# EAGLE design modbus (EAGLE 6.4)
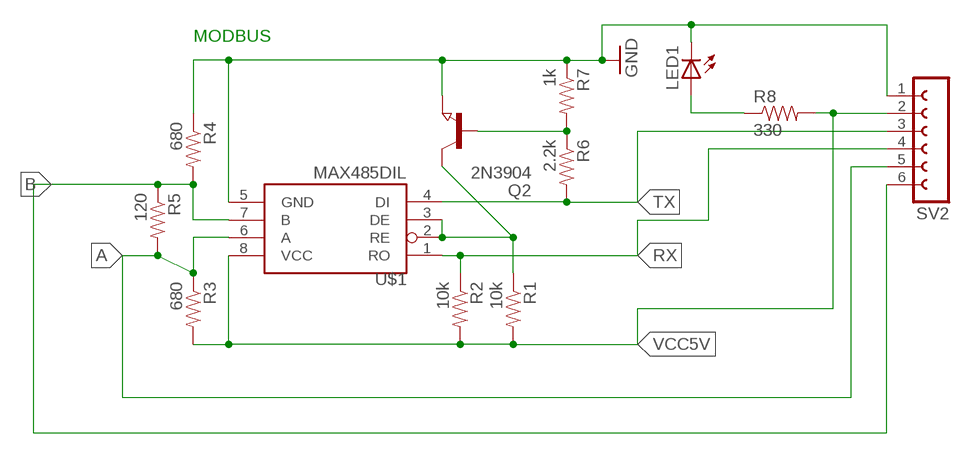
[diagram p0: schematic, sheet 1]

## Parts
LED1  LEDCHIP-LED0805  [CHIP-LED0805]
Q2  2N3904  NPN-TRANSISTOR_SOT23  [SOT23]
R1  10k  RESISTOR0805-RES  [0805]
R2  10k  RESISTOR0805-RES  [0805]
R3  680  RESISTOR0805-RES  [0805]
R4  680  RESISTOR0805-RES  [0805]
R5  120  RESISTOR0805-RES  [0805]
R6  2.2k  RESISTOR0805-RES  [0805]
R7  1k  RESISTOR0805-RES  [0805]
R8  330  RESISTOR0805-RES  [0805]
SV2  FE06-1  [FE06]
U$1  MAX485DIL  [DIL08]

## Nets
A: R3.1 R5.2 SV2.5 U$1.6(A)
B: R4.2 R5.1 SV2.6 U$1.7(B)
GND: LED1.C Q2.2(E) R4.1 R7.1 SV2.1 U$1.5(GND)
N$1: LED1.A R8.1
N$2: Q2.3(C) R1.1 U$1.2(RE) U$1.3(DE)
N$4: Q2.1(B) R6.1 R7.2
RX: R2.1 SV2.4 U$1.1(RO)
TX: R6.2 SV2.3 U$1.4(DI)
VCC5V: R1.2 R2.2 R3.2 R8.2 SV2.2 U$1.8(VCC)

## Notes on the sheet
- MODBUS

## Library data of the parts
LED1 = led:LED: LED OSRAM: - CHIPLED LG R971, LG N971, LY N971, LG Q971, LY Q971, LO R971, LY R971 LH N974, LH R974 LS Q976, LO Q976, LY Q976 LO Q996 - Hyper CHIPLED LW Q18S LB Q993, LB Q99A, LB R99A - SideLED LS A670, LO A670, LY A670, LG A670, LP A670 LB A673, LV A673, LT A673, LW A673 LH A674 LY A675 LS A676, LA A676, LO A676, LY A676, LW A676 LS A679, LY A679, LG A679 - Hyper Micro SIDELED® LS Y876, LA Y876, LO Y876, LY Y876 LT Y87S - SmartLED LW L88C, LW L88S LB L89C, LB L89S, LG L890 LS L89K, LO L89K, LY L89K LS L896, LA L896, LO L896, LY L896 - TOPLED LS T670, LO T670, LY T670, LG T670, LP T670 LSG T670, LSP T670, LSY T670, LOP T670, LYG T670 LG T671, LOG T671, LSG T671 LB T673, LV T673, LT T673, LW T673 LH T674 LS T676, LA T676, LO T676, LY T676, LB T676, LH T676, LSB T676, LW T676 LB T67C, LV T67C, LT T67C, LS T67K, LO T67K, LY T67K, LW E67C LS E67B, LA E67B, LO E67B, LY E67B, LB E67C, LV E67C, LT E67C LW T67C LS T679, LY T679, LG T679 LS T770, LO T770, LY T770, LG T770, LP T770 LB T773, LV T773, LT T773, LW T773 LH T774 LS E675, LA E675, LY E675, LS T675 LS T776, LA T776, LO T776, LY T776, LB T776 LHGB T686 LT T68C, LB T68C - Hyper Mini TOPLED® LB M676 - Mini TOPLED Santana® LG M470 LS M47K, LO M47K, LY M47K Source: http://www.osram.convergy.de LUXEON: - LUMILED® LXK2-PW12-R00, LXK2-PW12-S00, LXK2-PW14-U00, LXK2-PW14-V00 LXK2-PM12-R00, LXK2-PM12-S00, LXK2-PM14-U00 LXK2-PE12-Q00, LXK2-PE12-R00, LXK2-PE12-S00, LXK2-PE14-T00, LXK2-PE14-U00 LXK2-PB12-K00, LXK2-PB12-L00, LXK2-PB12-M00, LXK2-PB14-N00, LXK2-PB14-P00, LXK2-PB14-Q00 LXK2-PR12-L00, LXK2-PR12-M00, LXK2-PR14-Q00, LXK2-PR14-R00 LXK2-PD12-Q00, LXK2-PD12-R00, LXK2-PD12-S00 LXK2-PH12-R00, LXK2-PH12-S00 LXK2-PL12-P00, LXK2-PL12-Q00, LXK2-PL12-R00 Source: www.luxeon.com KINGBRIGHT: KA-3528ASYC Source: www.kingbright.com
Q2 = semicon-smd-ipc:NPN-TRANSISTOR_: NPN TRANSISTOR
R1-R8 = SparkFun-Passives:RESISTOR: Resistor Basic schematic elements and footprints for 0603, 1206, and PTH resistors.
SV2 = con-lsta:FE06-1: FEMALE HEADER; OC_FARNELL: unknown; OC_NEWARK: unknown
U$1 = SparkFun-DigitalIC:MAX485: RS-485 transceiver

## Net classes
0 default: width 0.3 mm, drill 0.5 mm, clearance 0.25 mm

## Board
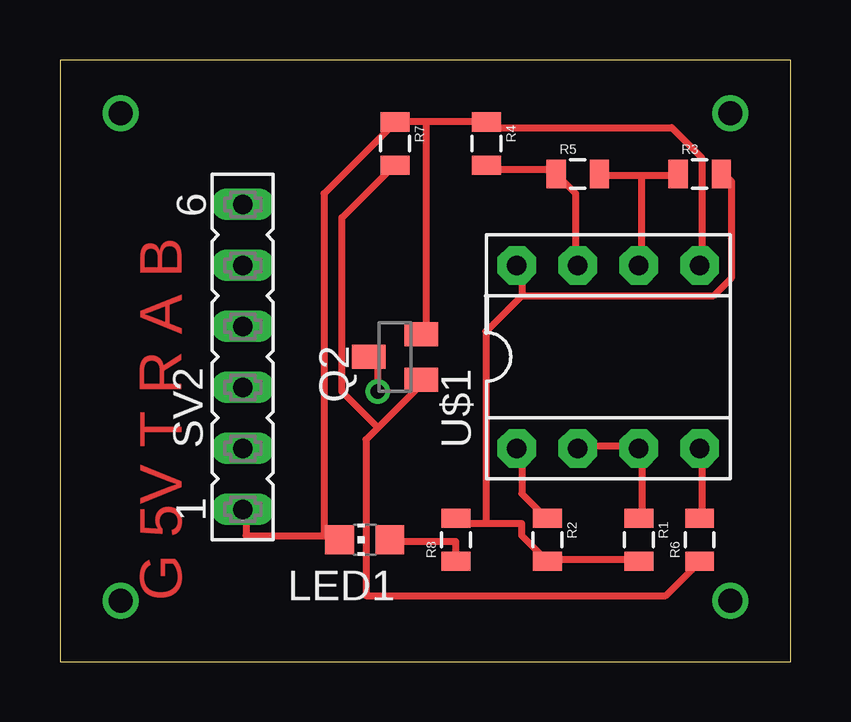
[diagram p1: board, top side]
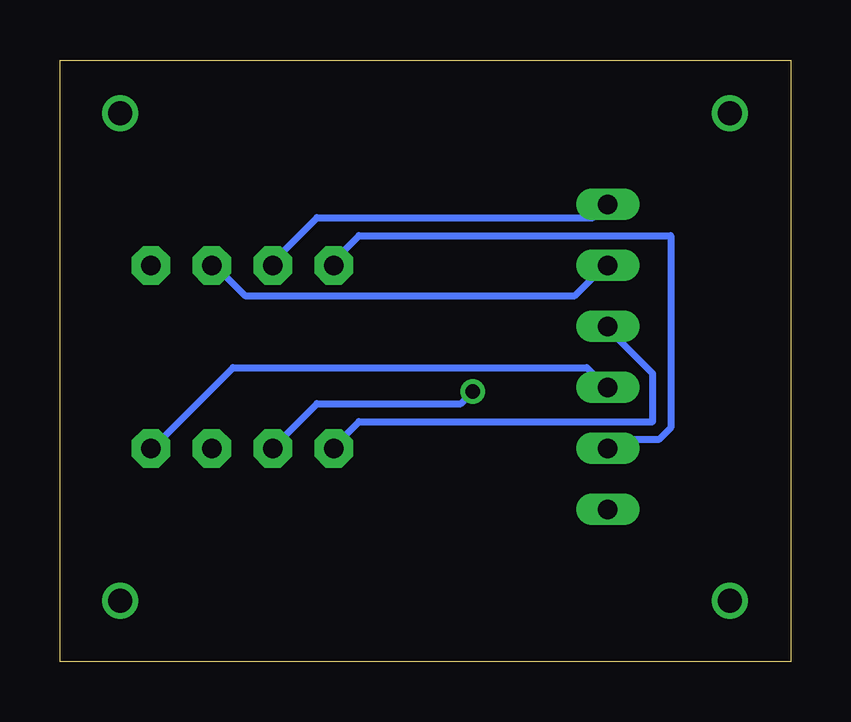
[diagram p2: board, bottom side, seen from below]

Size 30.46 x 25.07 mm. Coordinates in mm from the lower left corner, seen from the top.
Outline: 0,0 30.46,0 30.46,25.07 0,25.07 0,0
Copper layers (1*16): Top 0.035mm / dielectric 1.5mm / Bottom 0.035mm
Design rules "default": minimum track width 10mil, minimum drill 24mil, track to track 8mil, track to pad 8mil, pad to pad 8mil, via to via 8mil, smd to smd 8mil, copper to edge 40mil, drill to drill 8mil, minimum pad ring 10mil, minimum via ring 8mil, stop-mask expansion 4mil, vias tented up to drill 0mil, thermal gap 10mil

### Footprints (pad centres in the part's own frame; a part is rotated, then mirrored left to right if it is on the bottom)
CHIP-LED0805 = smd 1.2 x 1.2: A 0,-1.05; C 0,1.05
SOT23 = smd 1 x 1.4: 1 -0.95,-1.1; 2 0.95,-1.1; 3 0,1.1
0805 = smd 0.8 x 1.2: 1 -0.9,0; 2 0.9,0
FE06 = drill 0.813 long: 1 -6.35,0; 2 -3.81,0; 3 -1.27,0; 4 1.27,0; 5 3.81,0; 6 6.35,0
DIL08 = drill 0.813 pad 1.6 octagon: 1 -3.81,-3.81; 2 -1.27,-3.81; 3 1.27,-3.81; 4 3.81,-3.81; 5 3.81,3.81; 6 1.27,3.81; 7 -1.27,3.81; 8 -3.81,3.81

### Placement (x,y rotation side)
LED1  12.7,5.08 90 top
Q2  13.97,12.7 90 top
R1  24.13,5.08 270 top
R2  20.32,5.08 270 top
R3  26.67,20.32 0 top
R4  17.78,21.59 270 top
R5  21.59,20.32 0 top
R6  26.67,5.08 90 top
R7  13.97,21.59 270 top
R8  16.51,5.08 90 top
SV2  7.62,12.7 90 top
U$1  22.86,12.7 0 top

### Tracks (layer width: path | path; a pad name or v marks a point on that pad's centre or on a via)
A
  Top 0.3: 24.25,20.25 25.75,20.25 R3.1 | 24.25,20.25 22.5,20.25 R5.2 | 24.25,20.25 24.25,16.75 U$1.6
  Bottom 0.3: SV2.5 7.75,16.5 9,15.25 22.75,15.25 24,16.5 U$1.6
B
  Top 0.3: R4.2 18,20.5 20.5,20.5 R5.1 20.75,20.25 21.5,19.5 21.5,16.75 U$1.7
  Bottom 0.3: SV2.6 7.75,19 8.25,18.5 19.75,18.5 21.5,16.75 U$1.7
GND
  Top 0.3: 11,5.25 7.75,5.25 7.75,6.25 SV2.1 | 11,5.25 11.5,5.25 LED1.C | 15.25,22.5 17.75,22.5 R4.1 18,22.25 25.5,22.25 26.75,21 26.75,16.75 U$1.5 | 15.25,22.5 14,22.5 R7.1 13.75,22.25 11,19.5 11,5.25 | 15.25,22.5 15.25,13.75 Q2.2
N$1
  Top 0.3: LED1.A 13.75,5 16.5,5 16.5,4.25 R8.1
N$2  (via drill 0.61)
  Top 0.3: R1.1 24.25,6 24.25,8.75 U$1.3 24,9 21.75,9 U$1.2 | v13.25,11.25 13.25,12.25 13,12.5 Q2.3
  Bottom 0.3: v13.25,11.25 13.75,10.75 19.75,10.75 21.5,9 U$1.2
N$3  (via drill 1)
  other vias: 2.54,22.86
N$4
  Top 0.3: 13.25,9.75 15,11.5 15,11.75 Q2.1 | 13.25,9.75 12.75,9.25 12.75,2.75 25.25,2.75 26.5,4 R6.1 | 13.25,9.75 11.75,11.25 11.75,18.5 13.75,20.5 R7.2
N$5  (via drill 1)
  other vias: 27.94,22.86
N$6  (via drill 1)
  other vias: 27.94,2.54
N$7  (via drill 1)
  other vias: 2.54,2.54
RX
  Top 0.3: R2.1 20.25,6 19.25,7 19.25,8.75 U$1.1
  Bottom 0.3: SV2.4 7.5,13.75 5.75,12 5.75,10 18,10 19,9 U$1.1
TX
  Top 0.3: R6.2 26.75,6 26.75,8.75 U$1.4
  Bottom 0.3: SV2.3 7.75,11.5 8.5,12.25 23.25,12.25 26.5,9 U$1.4
VCC5V
  Top 0.3: R1.2 24,4.25 20.5,4.25 R2.2 19.25,5.25 19.25,5.75 17.75,5.75 | 17.75,5.75 16.75,5.75 R8.2 | 19.25,15.25 27.25,15.25 28,16 28,20 27.75,20.25 R3.2 | 19.25,15.25 19.25,16.5 U$1.8 | 17.75,5.75 17.75,13.75 19.25,15.25
  Bottom 0.3: SV2.2 7.5,9 7.25,9.25 5.5,9.25 5,9.75 5,17.75 18,17.75 19,16.75 U$1.8

### Text on the board
Top: G 5V T R A B